# EAGLE design advanced (EAGLE 7.4.0)
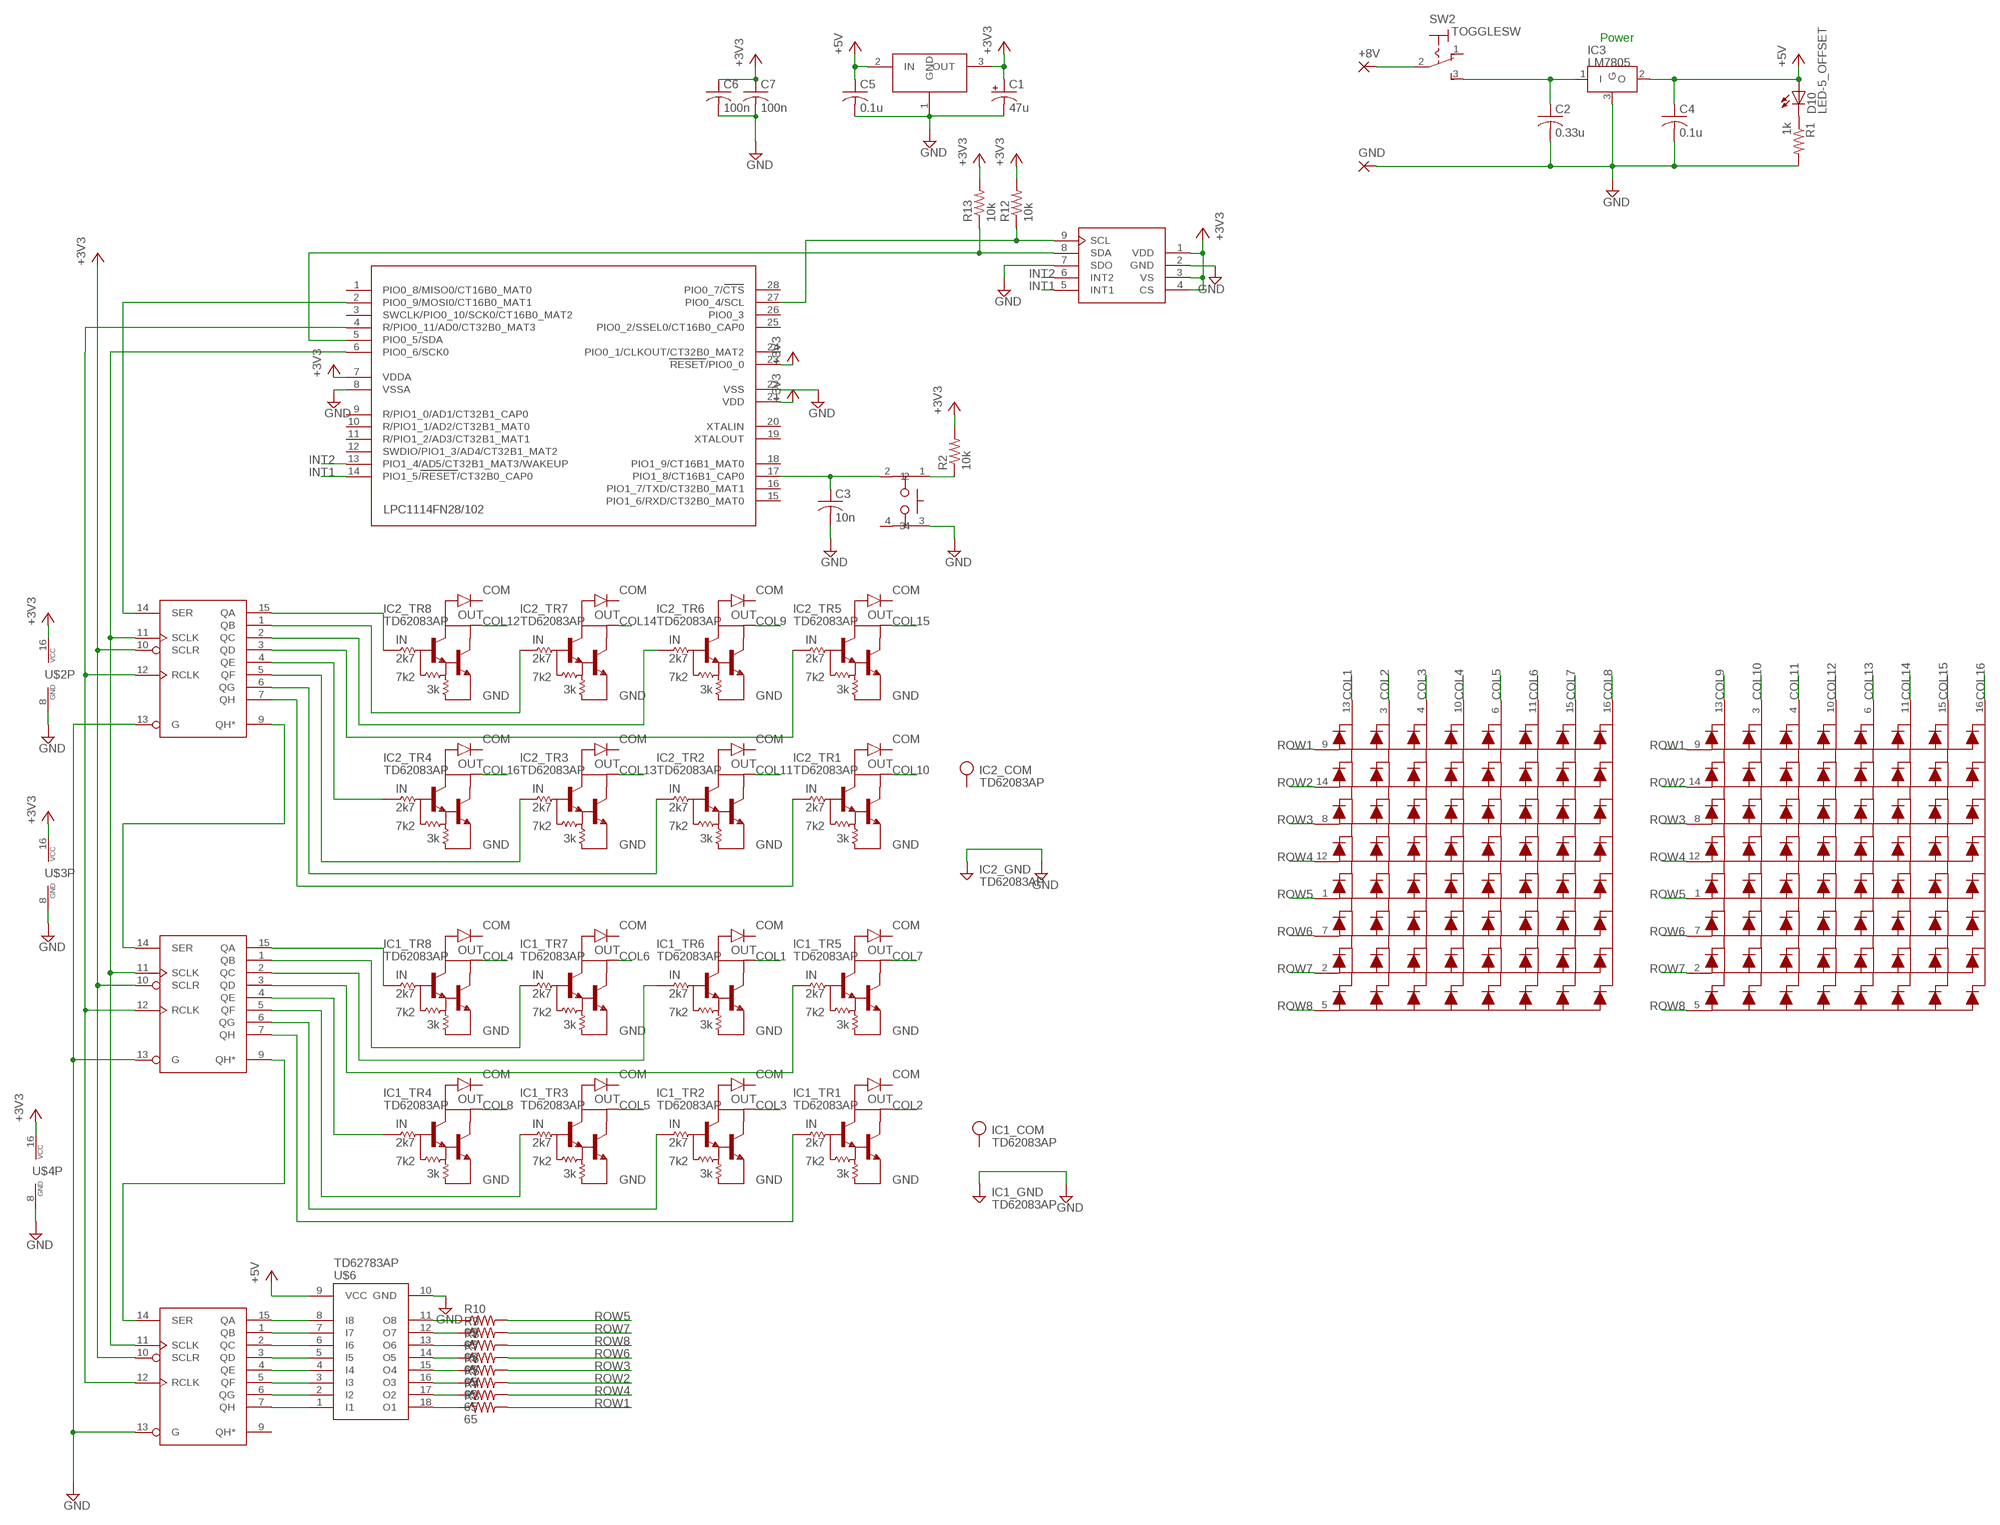
[diagram p0: schematic, sheet 1]

## Parts
+8V  POWERPAD-2.0  [POWERPAD-2.0]
C1  47u  CC-2.5-5  [E2,5-5]
C2  0.33u  C/2.5  [C025-024X044]
C3  10n  C/2.5  [C025-024X044]
C4  0.1u  C/2.5  [C025-024X044]
C5  0.1u  C/2.5  [C025-024X044]
C6  100n  C/2.5  [C025-024X044]
C7  100n  C/2.5  [C025-024X044]
D1  OSL641505-BX  [OSL641505-XX]
D10  LED-5_OFFSET  [LED5_OFFSET]
DELDEL  OSL641505-BX  [OSL641505-XX]
GND  POWERPAD-2.0  [POWERPAD-2.0]
IC1  TD62083AP  [DIL18]
IC2  TD62083AP  [DIL18]
IC3  LM7805  78(LARGEHOLE)  [7805-LARGEHOLE]
R1  1k  R/7  [0204/7]
R2  10k  R/7  [0204/7]
R3  65  R/7  [0204/7]
R4  65  R/7  [0204/7]
R5  65  R/7  [0204/7]
R6  65  R/7  [0204/7]
R7  65  R/7  [0204/7]
R8  65  R/7  [0204/7]
R9  65  R/7  [0204/7]
R10  65  R/7  [0204/7]
R12  10k  R/7  [0204/7]
R13  10k  R/7  [0204/7]
SW1  PUSHSW  [PUSHSW]
SW2  TOGGLESW  [TOGGLESW]
U$1  LPC1114FN28  [DIP28(600MIL)]
U$2  74HC595N  [DIL16]
U$3  74HC595N  [DIL16]
U$4  74HC595N  [DIL16]
U$5  AKI_ADXL345  [AKI_ADXL345]
U$6  TD62783AP  [DIL18]
U$8  S-812C3.3AY  [TO92-]

## Nets
+3V3: C1.+ C6.1 C7.1 R2.2 R12.2 R13.2 U$1.7(VDDA) U$1.21(VDD) U$1.23(RESET/PIO0_0) U$2.10(SCLR) U$2.16(VCC) U$3.10(SCLR) U$3.16(VCC) U$4.10(SCLR) U$4.16(VCC) U$5.1(VDD) U$5.3(VS) U$5.4(CS) U$8.3(OUT)
+5V: C4.1 C5.1 D10.A IC3.2(O) U$6.9(VCC) U$8.2(IN)
COL1: D1.13 IC1.13(_TR6:C)
COL2: D1.3 IC1.18(_TR1:C)
COL3: D1.4 IC1.17(_TR2:C)
COL4: D1.10 IC1.11(_TR8:C)
COL5: D1.6 IC1.16(_TR3:C)
COL6: D1.11 IC1.12(_TR7:C)
COL7: D1.15 IC1.14(_TR5:C)
COL8: D1.16 IC1.15(_TR4:C)
COL9: DELDEL.13 IC2.13(_TR6:C)
COL10: DELDEL.3 IC2.18(_TR1:C)
COL11: DELDEL.4 IC2.17(_TR2:C)
COL12: DELDEL.10 IC2.11(_TR8:C)
COL13: DELDEL.6 IC2.16(_TR3:C)
COL14: DELDEL.11 IC2.12(_TR7:C)
COL15: DELDEL.15 IC2.14(_TR5:C)
COL16: DELDEL.16 IC2.15(_TR4:C)
GND: C1.- C2.2 C3.2 C4.2 C5.2 C6.2 C7.2 GND.1(P) IC1.9(_GND:GND) IC2.9(_GND:GND) IC3.3(G) R1.2 SW1.3 U$1.8(VSSA) U$1.22(VSS) U$2.8(GND) U$2.13(G) U$3.8(GND) U$3.13(G) U$4.8(GND) U$4.13(G) U$5.2(GND) U$5.7(SDO) U$6.10(GND) U$8.1(GND)
INT1: U$1.14(PIO1_5/RESET/CT32B0_CAP0) U$5.5(INT1)
INT2: U$1.13(PIO1_4/AD5/CT32B1_MAT3/WAKEUP) U$5.6(INT2)
N$1: C3.1 SW1.2 U$1.17(PIO1_8/CT16B1_CAP0)
N$2: C2.1 IC3.1(I) SW2.3(S)
N$3: U$2.14(SER) U$3.9(QH*)
N$4: U$3.14(SER) U$4.9(QH*)
N$5: U$2.15(QA) U$6.8(I8)
N$6: +8V.1(P) SW2.2(P)
N$8: R12.1 U$1.27(PIO0_4/SCL) U$5.9(SCL)
N$9: R13.1 U$1.5(PIO0_5/SDA) U$5.8(SDA)
N$10: U$1.2(PIO0_9/MOSI0/CT16B0_MAT1) U$4.14(SER)
N$11: R2.1 SW1.1
N$12: U$1.4(R/PIO0_11/AD0/CT32B0_MAT3) U$2.12(RCLK) U$3.12(RCLK) U$4.12(RCLK)
N$13: IC1.4(_TR4:B) U$3.4(QE)
N$14: IC2.8(_TR8:B) U$4.15(QA)
N$15: IC2.7(_TR7:B) U$4.1(QB)
N$16: IC2.6(_TR6:B) U$4.2(QC)
N$17: U$2.1(QB) U$6.7(I7)
N$18: U$2.2(QC) U$6.6(I6)
N$19: U$2.3(QD) U$6.5(I5)
N$20: U$2.4(QE) U$6.4(I4)
N$21: U$2.5(QF) U$6.3(I3)
N$22: U$2.6(QG) U$6.2(I2)
N$23: U$2.7(QH) U$6.1(I1)
N$24: IC1.8(_TR8:B) U$3.15(QA)
N$25: IC1.7(_TR7:B) U$3.1(QB)
N$26: IC1.6(_TR6:B) U$3.2(QC)
N$27: IC1.5(_TR5:B) U$3.3(QD)
N$28: IC1.1(_TR1:B) U$3.7(QH)
N$29: IC1.2(_TR2:B) U$3.6(QG)
N$30: IC1.3(_TR3:B) U$3.5(QF)
N$32: IC2.5(_TR5:B) U$4.3(QD)
N$33: IC2.1(_TR1:B) U$4.7(QH)
N$34: IC2.2(_TR2:B) U$4.6(QG)
N$35: IC2.3(_TR3:B) U$4.5(QF)
N$36: U$1.6(PIO0_6/SCK0) U$2.11(SCLK) U$3.11(SCLK) U$4.11(SCLK)
N$37: IC2.4(_TR4:B) U$4.4(QE)
N$42: R3.1 U$6.18(O1)
N$43: R4.1 U$6.17(O2)
N$44: R5.1 U$6.16(O3)
N$45: R6.1 U$6.15(O4)
N$46: R7.1 U$6.14(O5)
N$47: R8.1 U$6.13(O6)
N$48: R9.1 U$6.12(O7)
N$49: R10.1 U$6.11(O8)
N$404: D10.K R1.1
ROW1: D1.9 DELDEL.9 R3.2
ROW2: D1.14 DELDEL.14 R5.2
ROW3: D1.8 DELDEL.8 R6.2
ROW4: D1.12 DELDEL.12 R4.2
ROW5: D1.1 DELDEL.1 R10.2
ROW6: D1.7 DELDEL.7 R7.2
ROW7: D1.2 DELDEL.2 R9.2
ROW8: D1.5 DELDEL.5 R8.2
Unconnected: IC1.10 IC2.10 SW1.4 SW2.1(O) SW2.SHELL1(SHELL) SW2.SHELL2(SHELL) U$1.1(PIO0_8/MISO0/CT16B0_MAT0) U$1.3(SWCLK/PIO0_10/SCK0/CT16B0_MAT2) U$1.9(R/PIO1_0/AD1/CT32B1_CAP0) U$1.10(R/PIO1_1/AD2/CT32B1_MAT0) U$1.11(R/PIO1_2/AD3/CT32B1_MAT1) U$1.12(SWDIO/PIO1_3/AD4/CT32B1_MAT2) U$1.15(PIO1_6/RXD/CT32B0_MAT0) U$1.16(PIO1_7/TXD/CT32B0_MAT1) U$1.18(PIO1_9/CT16B1_MAT0) U$1.19(XTALOUT) U$1.20(XTALIN) U$1.24(PIO0_1/CLKOUT/CT32B0_MAT2) U$1.25(PIO0_2/SSEL0/CT16B0_CAP0) U$1.26(PIO0_3) U$1.28(PIO0_7/CTS) U$2.9(QH*)

## Notes on the sheet
- Power

## Library data of the parts
+8V GND = Connector_Robotech:POWERPAD: THROUGH-HOLE PAD for Power supply cable
C1 = Passive_Robotech:CC
C2-C7 = Passive_Robotech:C
D1 DELDEL = Diode_Robotech:OSL641505-BX
D10 = Diode_Robotech:LED
IC1 IC2 = Transistor_Robotech:TD62083
IC3 = IC_Robotech:78*: Three Terminal Voltage Regulator
R1-R10 R12 R13 = Passive_Robotech:R
SW1 = Passive_Robotech:PUSHSW
SW2 = Passive_Robotech:TOGGLESW: 3-pin Toggle Switch sold in akidzuki @ 80yen (2008/04/09)
U$1 = MicroControler_Robotech:LPC1114FN28: LPC1114FN28(DIP600mil,ARM Cortex-M0)
U$2-U$4 = IC_Robotech:74*595
U$5 = Sensor_Robotech:AKI_ADXL345
U$6 = Transistor_Robotech:TD62783
U$8 = IC_Robotech:S-812C

## Board
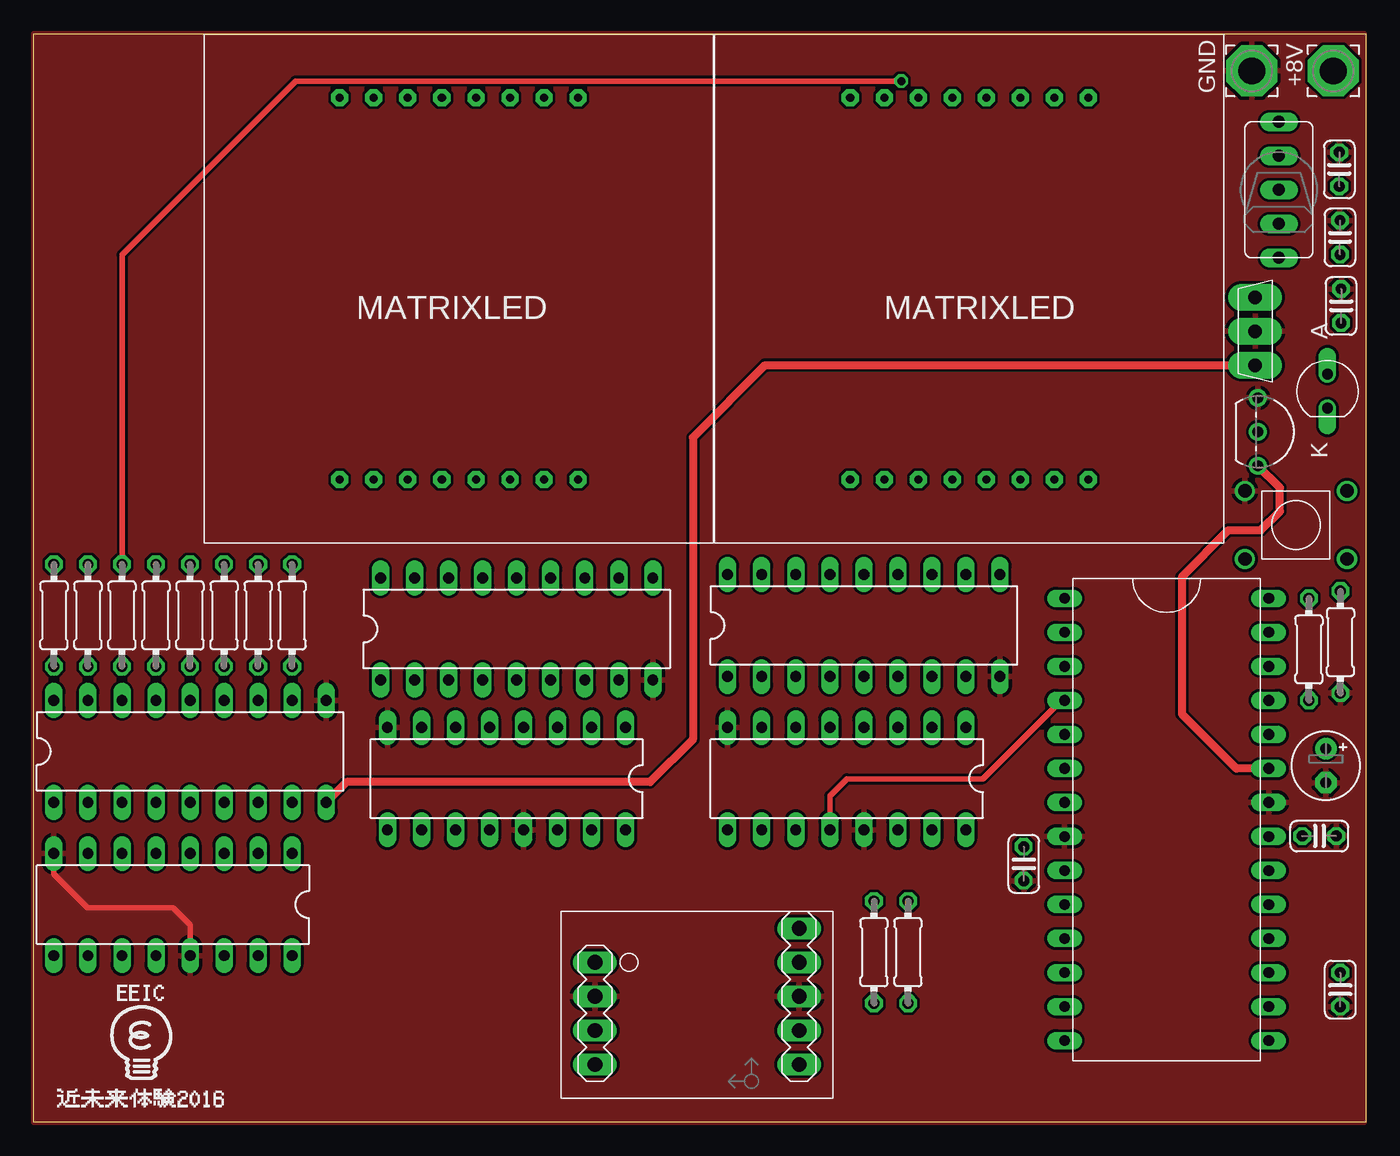
[diagram p1: board, top side]
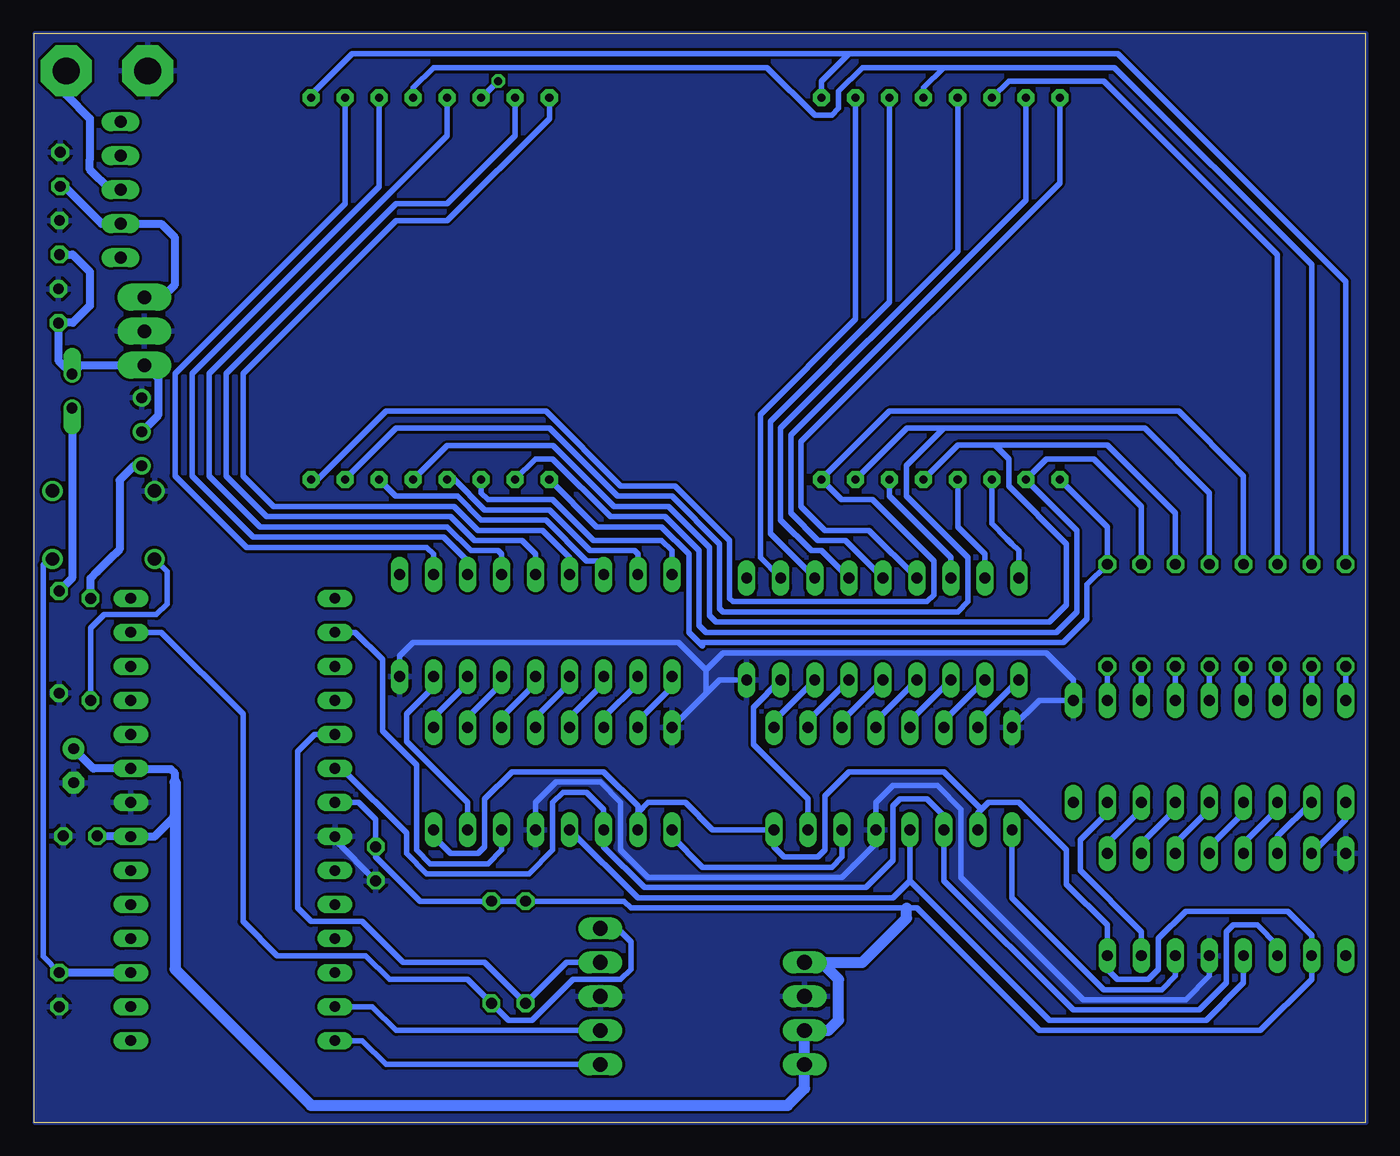
[diagram p2: board, bottom side, seen from below]

Size 99.46 x 81.28 mm. Coordinates in mm from the lower left corner, seen from the top.
Outline: 0,81.28 99.46,81.28 99.46,0 0,0 0,81.28
Copper layers (1*16): Top 0.0356mm / dielectric 1.5011mm / Bottom 0.0356mm
Design rules "formitaminimum": minimum track width 5mil, minimum drill 0.5994mm, track to track 0.2007mm, track to pad 0.2007mm, pad to pad 0.2007mm, via to via 0.2007mm, smd to smd 0mil, copper to edge 0mil, drill to drill 1mil, minimum pad ring 10mil, minimum via ring 8mil, stop-mask expansion 4mil, vias tented up to drill 0mil, thermal gap 10mil

### Footprints (pad centres in the part's own frame; a part is rotated, then mirrored left to right if it is on the bottom)
POWERPAD-2.0 = drill 2 pad 3.81 octagon: 1 0,0
E2,5-5 = drill 0.813 pad 1.6: + -1.27,0 | drill 0.813 pad 1.6 octagon: - 1.27,0
C025-024X044 = drill 0.813 octagon: 1 -1.27,0; 2 1.27,0
OSL641505-XX = drill 0.6 pad 1.27 octagon: 1 -8.89,-14.25; 2 -6.35,-14.25; 3 -3.81,-14.25; 4 -1.27,-14.25; 5 1.27,-14.25; 6 3.81,-14.25; 7 6.35,-14.25; 8 8.89,-14.25; 9 8.89,14.25; 10 6.35,14.25; 11 3.81,14.25; 12 1.27,14.25; 13 -1.27,14.25; 14 -3.81,14.25; 15 -6.35,14.25; 16 -8.89,14.25
LED5_OFFSET = drill 0.8 offset: A -1.27,0; K 1.27,0
DIL18 = drill 0.813 long: 1 -10.16,-3.81; 2 -7.62,-3.81; 3 -5.08,-3.81; 4 -2.54,-3.81; 5 0,-3.81; 6 2.54,-3.81; 7 5.08,-3.81; 8 7.62,-3.81; 9 10.16,-3.81; 10 10.16,3.81; 11 7.62,3.81; 12 5.08,3.81; 13 2.54,3.81; 14 0,3.81; 15 -2.54,3.81; 16 -5.08,3.81; 17 -7.62,3.81; 18 -10.16,3.81
7805-LARGEHOLE = drill 1.016 pad 2.032 long: 1 -2.54,0; 2 2.54,0; 3 0,0
0204/7 = drill 0.813 octagon: 1 -3.81,0; 2 3.81,0
PUSHSW = drill 1: 1 -2.54,3.81; 2 -2.54,-3.81; 3 2.54,3.81; 4 2.54,-3.81
TOGGLESW = drill 0.9 long: 1 0,2.54; 2 0,0; 3 0,-2.54; SHELL1 0,5.08; SHELL2 0,-5.08
DIP28(600MIL) = drill 0.8 long: 1 -7.62,16.51; 2 -7.62,13.97; 3 -7.62,11.43; 4 -7.62,8.89; 5 -7.62,6.35; 6 -7.62,3.81; 7 -7.62,1.27; 8 -7.62,-1.27; 9 -7.62,-3.81; 10 -7.62,-6.35; 11 -7.62,-8.89; 12 -7.62,-11.43; 13 -7.62,-13.97; 14 -7.62,-16.51; 15 7.62,-16.51; 16 7.62,-13.97; 17 7.62,-11.43; 18 7.62,-8.89; 19 7.62,-6.35; 20 7.62,-3.81; 21 7.62,-1.27; 22 7.62,1.27; 23 7.62,3.81; 24 7.62,6.35; 25 7.62,8.89; 26 7.62,11.43; 27 7.62,13.97; 28 7.62,16.51
DIL16 = drill 0.813 long: 1 -8.89,-3.81; 2 -6.35,-3.81; 3 -3.81,-3.81; 4 -1.27,-3.81; 5 1.27,-3.81; 6 3.81,-3.81; 7 6.35,-3.81; 8 8.89,-3.81; 9 8.89,3.81; 10 6.35,3.81; 11 3.81,3.81; 12 1.27,3.81; 13 -1.27,3.81; 14 -3.81,3.81; 15 -6.35,3.81; 16 -8.89,3.81
AKI_ADXL345 = drill 1.1 long: 1 -8.89,3.81; 2 -8.89,1.27; 3 -8.89,-1.27; 4 -8.89,-3.81; 5 6.35,-3.81; 6 6.35,-1.27; 7 6.35,1.27; 8 6.35,3.81; 9 6.35,6.35
TO92- = drill 0.813: 1 -2.54,0; 2 0,0; 3 2.54,0

### Placement (x,y rotation side)
+8V  97.03,78.49 0 top
C1  96.47,26.62 270 top
C2  97.47,71.14 90 top
C3  97.54,9.91 270 top
C4  97.52,66.06 90 top
C5  97.6,60.94 90 top
C6  95.97,21.37 0 top
C7  73.91,19.3 270 top
D1  31.75,62.23 0 top
D10  96.58,54.59 270 top
DELDEL  69.85,62.23 0 top
GND  90.93,78.49 0 top
IC1  36.07,36.83 0 top
IC2  61.98,37.08 0 top
IC3  91.19,59.05 270 top
R1  97.55,35.85 270 top
R2  95.2,35.31 90 top
R3  1.52,37.85 90 top
R4  4.06,37.85 90 top
R5  6.6,37.85 90 top
R6  9.14,37.85 90 top
R7  11.68,37.85 90 top
R8  14.22,37.85 90 top
R9  16.76,37.85 90 top
R10  19.3,37.85 90 top
R12  65.28,12.7 90 top
R13  62.74,12.7 90 top
SW1  94.23,44.59 90 top
SW2  92.96,69.61 0 top
U$1  84.58,22.61 0 top
U$2  10.41,16.26 180 top
U$3  35.31,25.65 180 top
U$4  60.71,25.65 180 top
U$5  50.8,8.13 0 top
U$6  11.68,27.69 0 top
U$7  [EEIC_LOGO]  0.76,0.76 0 top
U$8  91.39,51.55 270 top

### Tracks (layer width: path | path; a pad name or v marks a point on that pad's centre or on a via)
+3V3
  Top 0.61: U$1.23 89.79,26.42 85.72,30.48 85.72,40.73 89.2,44.2 91.63,44.2 93.03,45.6 93.03,47.37 U$8.3
  Bottom 0.406: U$1.7 75.18,23.88 73.91,22.61 C7.1 73.91,19.81 70.61,16.51 R12.2 | 28.7,23.37 28.19,23.88 25.91,23.88 22.35,20.32 22.35,17.78 19.3,14.73 U$2.16 19.3,11.43 18.54,10.67 16.26,10.67 15.49,11.43 15.49,13.72 13.46,15.75 5.84,15.75 4.06,13.97 U$2.10 4.06,10.67 7.87,6.86 24.38,6.86 33.53,16 34.29,16 54.86,16 55.37,16.51 R12.2 | 28.7,23.37 28.96,23.11 U$3.10 28.96,22.35 | 54.36,23.11 53.59,23.88 50.8,23.88 48.77,21.84 U$3.16 44.2,20.57 43.43,19.81 40.89,19.81 40.39,20.32 40.39,24.38 38.61,26.16 31.5,26.16 28.7,23.37 | U$4.10 54.36,23.11 | U$4.16 69.6,21.34 68.33,20.07 66.29,20.07 65.79,20.57 65.79,24.13 63.75,26.16 56.9,26.16 54.36,23.62 54.36,23.11 | R12.2 R13.2
  Bottom 0.61: C6.1 92.23,21.37 U$1.21 90.42,21.34 88.9,22.86 | C1.+ 95,26.42 U$1.23 92.14,26.35 89.22,26.35 88.9,26.04 88.9,25.4 | U$8.3 91.96,49.01 93.03,47.94 93.03,42.77 93.8,42 94.7,41.1 95.2,40.6 R2.2
  Bottom 0.813: 88.9,25.4 88.9,22.86 88.9,11.43 78.74,1.27 43.18,1.27 41.91,2.54 U$5.4 U$5.3 40.13,6.86 39.37,7.62 39.37,10.67 40.64,11.94 | U$5.1 40.64,11.94 | 40.64,11.94 37.59,11.94 34.29,15.24 34.29,16
+5V
  Top 0.61: U$6.9 23.37,25.4 46.04,25.4 49.21,28.57 49.21,51.12 54.61,56.52 IC3.2
  Bottom 0.61: C4.1 96.54,64.79 95.25,63.5 95.25,60.96 96.52,59.69 97.58,59.69 C5.1 97.6,56.87 D10.A 95.92,56.52 IC3.2 91.12,56.52 90.17,55.56 90.17,52.77 U$8.2
COL1
  Bottom 0.406: D1.13 30.48,65.02 43.69,51.82 43.69,44.96 41.4,42.67 40.64,42.67 IC1.13
COL2
  Bottom 0.406: D1.3 27.94,44.7 26.8,43.56 26.42,43.18 25.91,42.67 IC1.18
COL3
  Bottom 0.406: D1.4 30.48,44.45 28.45,42.42 IC1.17
COL4
  Bottom 0.406: D1.10 38.1,59.94 45.21,52.83 45.21,42.16 IC1.11
COL5
  Bottom 0.406: D1.6 35.56,46.74 31.88,43.05 31.5,42.67 30.99,42.16 IC1.16
COL6
  Bottom 0.406: D1.11 35.56,61.21 44.45,52.32 44.45,43.94 IC1.12
COL7
  Bottom 0.406: D1.15 25.4,68.83 42.93,51.31 42.93,45.47 40.89,43.43 38.86,43.43 IC1.14
COL8
  Bottom 0.406: D1.16 22.86,70.1 42.16,50.8 42.16,45.97 40.39,44.2 37.08,44.2 IC1.15
COL9
  Bottom 0.406: DELDEL.13 68.58,73.66 86.36,55.88 86.36,48.26 82.55,44.45 68.58,44.45 66.8,42.67 64.77,42.67 64.52,42.42 IC2.13
COL10
  Bottom 0.406: DELDEL.3 66.04,46.99 65.53,46.48 60.71,46.48 57.66,43.43 52.58,43.43 51.82,42.67 IC2.18
COL11
  Bottom 0.406: IC2.17 54.36,42.42 54.61,42.67 57.91,42.67 60.96,45.72 65.79,45.72 68.07,48.01 68.55,48.01 DELDEL.4
COL12
  Bottom 0.406: DELDEL.10 76.2,68.58 88.9,55.88 88.9,48.26 83.57,42.93 70.1,42.93 69.6,42.42 IC2.11
COL13
  Bottom 0.406: DELDEL.6 72.42,46.74 67.82,46.74 66.04,44.96 61.21,44.96 58.17,41.91 57.15,41.91 56.9,41.66 IC2.16
COL14
  Bottom 0.406: DELDEL.11 73.66,69.85 87.63,55.88 87.63,48.26 83.06,43.69 68.83,43.69 67.06,41.91 IC2.12
COL15
  Bottom 0.406: DELDEL.15 63.5,73.66 68.58,68.58 72.39,68.58 85.09,55.88 85.09,48.26 82.04,45.21 68.33,45.21 66.55,43.43 62.99,43.43 61.98,42.42 IC2.14
COL16
  Bottom 0.406: DELDEL.16 60.96,74.93 68.58,67.31 72.39,67.31 83.82,55.88 83.82,48.26 81.53,45.97 68.07,45.97 67.82,45.72 67.69,45.59 66.29,44.2 61.47,44.2 59.44,42.16 IC2.15
GND
  Top 0.406: U$2.8 1.52,18.54 4.06,16 10.41,16 11.68,14.73 U$2.13
  Bottom 0.406: U$3.8 24.38,31.5 U$6.10 21.84,33.02 23.88,35.05 48.01,35.05 49.28,33.78 | U$4.8 49.28,32 | U$1.8 76.96,21.08 C7.2 | U$4.13 61.98,23.88 60.45,25.4 57.15,25.4 55.63,23.88 55.63,20.32 53.59,18.29 39.12,18.29 36.58,20.83 U$3.13 36.58,23.88 35.31,25.15 32,25.15 30.23,23.37 30.23,18.29 21.08,9.14 13.46,9.14 11.68,10.92 U$2.13 | 49.28,33.78 49.28,32 | IC1.9 48.26,33.02 49.28,32 | IC2.9 72.14,34.8 71.12,35.81 51.31,35.81 49.28,33.78
  pour Top: 0,81.28 99.32,81.28 99.32,0 0,0
  pour Bottom: 0,81.28 99.32,81.28 99.32,0 0,0
INT1
  Bottom 0.406: U$5.5 73.15,4.32 74.93,6.1 U$1.14
INT2
  Bottom 0.406: U$5.6 72.39,6.86 74.17,8.64 U$1.13
N$1
  Bottom 0.406: C3.1 98.74,12.38 98.74,41.59 98.28,42.05 SW1.2
  Bottom 0.61: U$1.17 C3.1
N$2
  Bottom 0.61: IC3.1 89.85,61.59 88.9,62.55 88.9,66.04 89.93,67.07 SW2.3 94.38,67.07 97.17,69.87 C2.1
N$3
  Bottom 0.406: U$3.9 26.42,16.76 19.56,9.91 15.24,9.91 14.22,10.92 U$2.14
N$4
  Bottom 0.406: U$4.9 51.82,21.34 49.53,19.05 39.88,19.05 39.12,19.81 U$3.14
N$5
  Bottom 0.406: U$6.8 19.3,23.11 21.34,21.08 21.34,18.8 16.76,14.22 U$2.15
N$6
  Bottom 0.61: +8V.1 97.03,76.71 95.25,74.93 95.25,72.39 95.25,71.9 95.25,71.12 93.74,69.61 SW2.2
N$8
  Bottom 0.406: U$1.27 89.92,36.58 83.82,30.48 83.82,14.99 81.28,12.45 74.68,12.45 72.9,10.67 67.06,10.67 R12.1 64.01,7.62 62.23,7.62 59.18,10.67 55.63,10.67 54.86,11.43 54.86,13.46 55.88,14.48 U$5.9
N$9
  Bottom 0.406: U$1.5 78.49,28.96 79.76,27.69 79.76,16 78.74,14.99 74.93,14.99 71.88,11.94 65.79,11.94 R13.1 59.69,11.94 U$5.8
N$10
  Bottom 0.406: U$4.14 64.52,20.32 65.53,19.3 69.85,19.3 70.87,20.32 70.87,26.67 73.41,29.21 73.41,34.54 75.44,36.58 U$1.2
N$11
  Bottom 0.406: R2.1 95.2,36.9 94.2,37.9 90.3,37.9 89.5,38.7 89.5,41.1 90.42,42.02 SW1.1
N$12
  Top 0.406: U$4.12 59.44,24.38 60.71,25.65 70.87,25.65 74.93,29.72 75.44,30.23 76.71,31.5 U$1.4
  Bottom 0.406: U$2.12 9.14,10.41 11.94,7.62 23.62,7.62 34.04,18.03 | U$3.12 34.04,18.03 | 34.04,18.03 35.31,16.76 54.36,16.76 U$4.12
N$13
  Bottom 0.406: IC1.4 36.58,29.97 U$3.4
N$14
  Bottom 0.406: IC2.8 69.6,32.51 71.63,30.48 71.63,28.45 67.06,23.88 U$4.15
N$15
  Bottom 0.406: IC2.7 67.06,32.77 69.6,30.23 U$4.1
N$16
  Bottom 0.406: IC2.6 64.52,32.77 67.06,30.23 U$4.2
N$17
  Bottom 0.406: U$6.7 16.76,23.37 19.3,20.83 U$2.1
N$18
  Bottom 0.406: U$6.6 14.22,23.37 16.76,20.83 U$2.2
N$19
  Bottom 0.406: U$6.5 11.68,23.37 14.22,20.83 U$2.3
N$20
  Bottom 0.406: U$6.4 9.14,23.11 11.68,20.57 U$2.4
N$21
  Bottom 0.406: U$6.3 6.6,23.37 9.14,20.83 U$2.5
N$22
  Bottom 0.406: U$6.2 6.6,21.34 U$2.6
N$23
  Bottom 0.406: U$6.1 1.52,22.61 U$2.7
N$24
  Bottom 0.406: U$3.15 41.66,24.13 45.72,28.19 45.72,30.99 IC1.8
N$25
  Bottom 0.406: IC1.7 44.2,29.97 U$3.1
N$26
  Bottom 0.406: IC1.6 41.66,29.97 U$3.2
N$27
  Bottom 0.406: IC1.5 39.12,29.97 U$3.3
N$28
  Bottom 0.406: IC1.1 28.96,29.97 U$3.7
N$29
  Bottom 0.406: IC1.2 31.5,29.97 U$3.6
N$30
  Bottom 0.406: IC1.3 34.04,29.97 U$3.5
N$32
  Bottom 0.406: IC2.5 61.98,32.77 64.52,30.23 U$4.3
N$33
  Bottom 0.406: U$4.7 54.36,29.97 51.82,32.51 IC2.1
N$34
  Bottom 0.406: IC2.2 54.36,32.77 56.9,30.23 U$4.6
N$35
  Bottom 0.406: U$4.5 59.44,30.23 56.9,32.77 IC2.3
N$36
  Bottom 0.406: U$2.11 6.6,13.21 8.13,14.73 9.91,14.73 10.41,14.22 10.41,10.41 12.45,8.38 21.84,8.38 31.5,18.03 U$3.11 31.5,22.86 32.77,24.13 34.8,24.13 35.31,23.62 35.31,19.56 37.34,17.53 53.85,17.53 56.9,20.57 U$4.11 56.9,23.37 58.17,24.64 59.94,24.64 60.71,23.88 60.71,20.32 62.48,18.54 70.1,18.54 71.63,20.07 71.63,21.59 76.45,26.42 U$1.6
N$37
  Bottom 0.406: IC2.4 59.44,32.77 61.98,30.23 U$4.4
N$42
  Bottom 0.406: R3.1 U$6.18
N$43
  Bottom 0.406: R4.1 U$6.17
N$44
  Bottom 0.406: R5.1 U$6.16
N$45
  Bottom 0.406: R6.1 U$6.15
N$46
  Bottom 0.406: R7.1 U$6.14
N$47
  Bottom 0.406: R8.1 U$6.13
N$48
  Bottom 0.406: R9.1 U$6.12
N$49
  Bottom 0.406: R10.1 U$6.11
N$404
  Bottom 0.61: D10.K 96.58,40.62 R1.1
ROW1
  Bottom 0.406: DELDEL.9 78.74,76.71 75.69,79.76 38.61,79.76 | R3.2 1.52,62.77 18.51,79.76 38.61,79.76 | D1.9 40.64,77.72 38.61,79.76
ROW2  (via drill 0.6)
  Top 0.406: v64.77,77.72 19.56,77.72 6.6,64.77 R5.2
  Bottom 0.406: D1.14 27.91,76.48 26.67,77.72 19.56,77.72 6.6,64.77 R5.2 | DELDEL.14 66.04,76.71 65.79,76.71 v64.77,77.72
ROW3
  Bottom 0.406: DELDEL.8 78.26,47.98 73.15,53.09 61.21,53.09 55.63,47.5 51.56,47.5 47.5,43.43 47.5,39.12 47.24,38.86 32.77,38.86 32.26,39.37 32.26,41.91 36.83,46.48 39.14,46.48 D1.8 40.64,48.01 35.56,53.09 13.97,53.09 9.14,48.26 R6.2
ROW4
  Bottom 0.406: 31.5,78.74 37.59,78.74 39.37,76.96 39.37,75.69 39.88,75.18 41.15,75.18 44.7,78.74 69.6,78.74 71.12,77.22 DELDEL.12 | 31.5,78.74 18.77,78.74 4.06,64.03 R4.2 | D1.12 33.02,77.22 31.5,78.74
ROW5
  Bottom 0.406: DELDEL.1 57.43,44.45 52.58,44.45 50.55,42.42 50.55,36.58 49.78,35.81 | 19.3,44.45 22.83,47.98 D1.1 19.3,44.42 R10.2 20.83,40.13 20.83,37.59 22.61,35.81 49.78,35.81 | 49.53,35.56 49.78,35.81
ROW6
  Bottom 0.406: D1.7 34.26,51.82 31.5,51.82 | 31.5,51.82 16.51,51.82 11.68,46.99 R7.2 | DELDEL.7 76.2,48.01 72.39,51.82 60.96,51.82 55.88,46.74 51.82,46.74 48.26,43.18 48.26,38.35 48.01,38.1 30.48,38.1 29.72,38.86 29.72,42.16 34.29,46.74 34.29,49.02 31.5,51.82
ROW7
  Bottom 0.406: DELDEL.2 63.5,48.01 61.98,49.53 60.71,49.53 56.39,45.21 52.32,45.21 49.78,42.67 49.78,37.08 49.28,36.58 23.11,36.58 21.59,38.1 21.59,44.17 D1.2 23.85,49.53 20.32,49.53 16.76,45.97 R9.2
ROW8
  Bottom 0.406: D1.5 30.45,50.55 27.69,50.55 | 27.69,50.55 19.3,50.55 14.22,45.47 R8.2 | 71.12,48.01 DELDEL.5 68.58,50.52 60.68,50.52 56.13,45.97 52.07,45.97 49.02,42.93 49.02,37.85 48.51,37.34 23.62,37.34 22.35,38.61 22.35,43.18 26.67,47.5 26.67,49.53 27.69,50.55

### Text on the board
tNames: MATRIXLED | MATRIXLED